# Altium schematic sheet Neopixels.SchDoc
size A; SheetNumber: 2; SheetTotal: 3
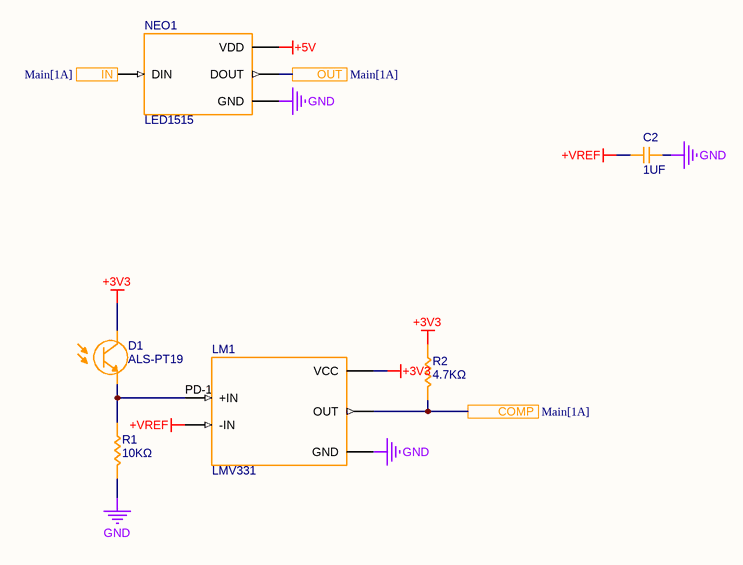
[diagram p0: Neopixels.SchDoc]

## Parts
C2  1UF  [CAP_0603]
D1  ALS-PT19  [ALS-PT19]
LM1  LMV331  [LMV331]
NEO1  LED1515  [LED1515]
R1  10KΩ  [RES_0603]
R2  4.7KΩ  [RES_0603]

## Ports
COMP (see Main[1A]), IN (see Main[1A]), OUT (see Main[1A])

## Nets
+3V3: D1.C LM1.5(VCC) R2.2
+5V: NEO1.VDD
+VREF: C2.2 LM1.3(-IN)
GND: C2.1 LM1.2(GND) NEO1.GND R1.1
COMP: LM1.4(OUT) R2.1 ; port COMP
IN: NEO1.DIN ; port IN
OUT: NEO1.DOUT ; port OUT
PD-1: D1.E LM1.1(+IN) R1.2

## Library data of the parts
C2 = CAP_0603: Capacitor SMD 0603 generic
R1 R2 = RES_0603: Resistor SMD 0603 generic